# Altium schematic sheet lv_io_analog_input.SchDoc
size A4; Organization: Badgerloop; Address1: 133 Engineering Research; Address2: Building; Address3: Madison, WI 53715
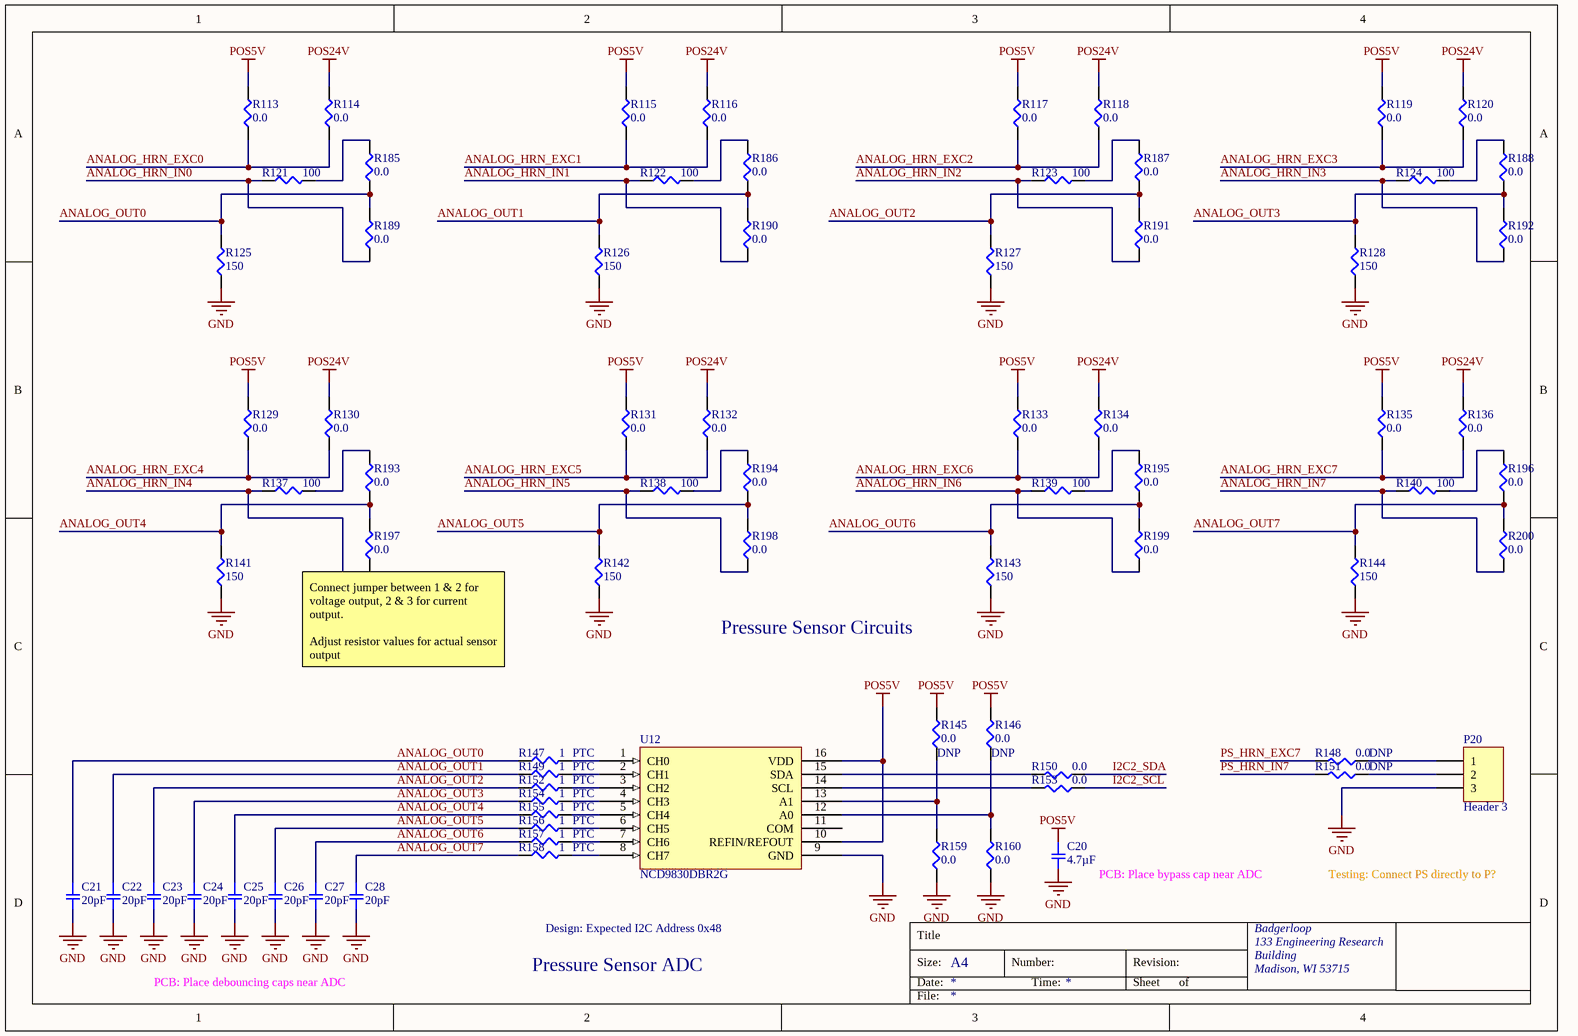
[diagram p0: lv_io_analog_input.SchDoc]

## Parts
C20  4.7µF  [SMD-0805C]
C21  20pF  [SMD-0402C]
C22  20pF  [SMD-0402C]
C23  20pF  [SMD-0402C]
C24  20pF  [SMD-0402C]
C25  20pF  [SMD-0402C]
C26  20pF  [SMD-0402C]
C27  20pF  [SMD-0402C]
C28  20pF  [SMD-0402C]
P20  Header 3  [Pin Header 1x3 TH Pitch 2.54mm]
R113  0.0  [SMD-0402-RES]
R114  0.0  [SMD-0402-RES]
R115  0.0  [SMD-0402-RES]
R116  0.0  [SMD-0402-RES]
R117  0.0  [SMD-0402-RES]
R118  0.0  [SMD-0402-RES]
R119  0.0  [SMD-0402-RES]
R120  0.0  [SMD-0402-RES]
R121  100  [SMD-0402-RES]
R122  100  [SMD-0402-RES]
R123  100  [SMD-0402-RES]
R124  100  [SMD-0402-RES]
R125  150  [SMD-0603-RES]
R126  150  [SMD-0603-RES]
R127  150  [SMD-0603-RES]
R128  150  [SMD-0603-RES]
R129  0.0  [SMD-0402-RES]
R130  0.0  [SMD-0402-RES]
R131  0.0  [SMD-0402-RES]
R132  0.0  [SMD-0402-RES]
R133  0.0  [SMD-0402-RES]
R134  0.0  [SMD-0402-RES]
R135  0.0  [SMD-0402-RES]
R136  0.0  [SMD-0402-RES]
R137  100  [SMD-0402-RES]
R138  100  [SMD-0402-RES]
R139  100  [SMD-0402-RES]
R140  100  [SMD-0402-RES]
R141  150  [SMD-0603-RES]
R142  150  [SMD-0603-RES]
R143  150  [SMD-0603-RES]
R144  150  [SMD-0603-RES]
R145  0.0  [SMD-0402-RES]
R146  0.0  [SMD-0402-RES]
R147  1  Features: PTC  [SMD-0603-RES]
R148  0.0  [SMD-0402-RES]
R149  1  Features: PTC  [SMD-0603-RES]
R150  0.0  [SMD-0402-RES]
R151  0.0  [SMD-0402-RES]
R152  1  Features: PTC  [SMD-0603-RES]
R153  0.0  [SMD-0402-RES]
R154  1  Features: PTC  [SMD-0603-RES]
R155  1  Features: PTC  [SMD-0603-RES]
R156  1  Features: PTC  [SMD-0603-RES]
R157  1  Features: PTC  [SMD-0603-RES]
R158  1  Features: PTC  [SMD-0603-RES]
R159  0.0  [SMD-0402-RES]
R160  0.0  [SMD-0402-RES]
R185  0.0  [SMD-0402-RES]
R186  0.0  [SMD-0402-RES]
R187  0.0  [SMD-0402-RES]
R188  0.0  [SMD-0402-RES]
R189  0.0  [SMD-0402-RES]
R190  0.0  [SMD-0402-RES]
R191  0.0  [SMD-0402-RES]
R192  0.0  [SMD-0402-RES]
R193  0.0  [SMD-0402-RES]
R194  0.0  [SMD-0402-RES]
R195  0.0  [SMD-0402-RES]
R196  0.0  [SMD-0402-RES]
R197  0.0  [SMD-0402-RES]
R198  0.0  [SMD-0402-RES]
R199  0.0  [SMD-0402-RES]
R200  0.0  [SMD-0402-RES]
U12  NCD9830DBR2G  [TSOP65P640X120_HS-17N]

## Nets
GND: C20.2 C21.2 C22.2 C23.2 C24.2 C25.2 C26.2 C27.2 C28.2 P20.3 R125.1 R126.1 R127.1 R128.1 R141.1 R142.1 R143.1 R144.1 R159.1 R160.1 U12.9(GND)
POS5V: C20.1 R113.2 R115.2 R117.2 R119.2 R129.2 R131.2 R133.2 R135.2 R145.2 R146.2 U12.10(REFIN/REFOUT) U12.16(VDD)
POS24V: R114.2 R116.2 R118.2 R120.2 R130.2 R132.2 R134.2 R136.2
ANALOG_HRN_EXC0: R113.1 R114.1
ANALOG_HRN_EXC1: R115.1 R116.1
ANALOG_HRN_EXC2: R117.1 R118.1
ANALOG_HRN_EXC3: R119.1 R120.1
ANALOG_HRN_EXC4: R129.1 R130.1
ANALOG_HRN_EXC5: R131.1 R132.1
ANALOG_HRN_EXC6: R133.1 R134.1
ANALOG_HRN_EXC7: R135.1 R136.1
ANALOG_HRN_IN0: R121.1 R189.1
ANALOG_HRN_IN1: R122.1 R190.1
ANALOG_HRN_IN2: R123.1 R191.1
ANALOG_HRN_IN3: R124.1 R192.1
ANALOG_HRN_IN4: R137.1 R197.1
ANALOG_HRN_IN5: R138.1 R198.1
ANALOG_HRN_IN6: R139.1 R199.1
ANALOG_HRN_IN7: R140.1 R200.1
ANALOG_OUT0: C21.1 R125.2 R147.1 R185.1 R189.2
ANALOG_OUT1: C22.1 R126.2 R149.1 R186.1 R190.2
ANALOG_OUT2: C23.1 R127.2 R152.1 R187.1 R191.2
ANALOG_OUT3: C24.1 R128.2 R154.1 R188.1 R192.2
ANALOG_OUT4: C25.1 R141.2 R155.1 R193.1 R197.2
ANALOG_OUT5: C26.1 R142.2 R156.1 R194.1 R198.2
ANALOG_OUT6: C27.1 R143.2 R157.1 R195.1 R199.2
ANALOG_OUT7: C28.1 R144.2 R158.1 R196.1 R200.2
I2C2_SCL: R153.1
I2C2_SDA: R150.1
PS_HRN_EXC7: R148.2
PS_HRN_IN7: R151.2
NetP20_1: P20.1 R148.1
NetP20_2: P20.2 R151.1
NetR121_2: R121.2 R185.2
NetR122_2: R122.2 R186.2
NetR123_2: R123.2 R187.2
NetR124_2: R124.2 R188.2
NetR137_2: R137.2 R193.2
NetR138_2: R138.2 R194.2
NetR139_2: R139.2 R195.2
NetR140_2: R140.2 R196.2
NetR145_1: R145.1 R159.2 U12.13(A1)
NetR146_1: R146.1 R160.2 U12.12(A0)
NetR147_2: R147.2 U12.1(CH0)
NetR149_2: R149.2 U12.2(CH1)
NetR150_2: R150.2 U12.15(SDA)
NetR152_2: R152.2 U12.3(CH2)
NetR153_2: R153.2 U12.14(SCL)
NetR154_2: R154.2 U12.4(CH3)
NetR155_2: R155.2 U12.5(CH4)
NetR156_2: R156.2 U12.6(CH5)
NetR157_2: R157.2 U12.7(CH6)
NetR158_2: R158.2 U12.8(CH7)

Not connected (* = marked no-connect by the designer): U12 11(COM)

## Notes on the sheet
- Pressure Sensor Circuits
- (near R197) Connect jumper between 1 & 2 for voltage output, 2 & 3 for current output.
  Adjust resistor values for actual sensor output
- (near C20) PCB: Place bypass cap near ADC
- Testing: Connect PS directly to P?
- PCB: Place debouncing caps near ADC
- Pressure Sensor ADC
- Design: Expected I2C Address 0x48
- Title
- Size:
- Date:
- A4
- Number:
- Time:
- Revision:
- Sheet
- of
- File:

## Library data of the parts
C20 = GRM21BR60J475KA11L: CAP CER 4.7UF 6.3V X5R 0805; Manufacturer: Murata Electronics North America; Factory Stock: 0; Unit Price (USD): 0.28; Minimum Quantity: 1; Tolerance: ±10%; Datasheets: http://www.murata.com/~/media/webrenewal/support/library/catalog/products/capacitor/mlcc/c02e.pdf; Image: //media.digikey.com/Renders/Murata%20Renders/0805%20(2012%20Metric)%20.85mm.jpg; Digi-Key Part Number: 490-9749-1-ND; Part Number: GRM21BR60J475KA11L; Quantity Available: 2821; @ qty: 0; Packaging: Cut Tape (CT); Series: GRM; Part Status: Active; Value: 4.7µF; Voltage: 6.3V; Temperature Coefficient: X5R; Operating Temperature: -55°C ~ 85°C; Features: -; Ratings: -; Applications: General Purpose; Mounting Type: Surface Mount, MLCC; Package / Case: 0805 (2012 Metric); Size / Dimension: 0.079" L x 0.049" W (2.00mm x 1.25mm); Height - Seated (Max): -; Thickness (Max): 0.055" (1.40mm); Lead Spacing: -; Lead Style: -
C21-C28 = GJM1555C1H200JB01D: CAP CER 20PF 50V NP0 0402; Manufacturer: Murata Electronics North America; Factory Stock: 0; Unit Price (USD): 0.1; Minimum Quantity: 1; Tolerance: ±5%; Temperature Coefficient: C0G, NP0; Datasheets: http://www.murata.com/~/media/webrenewal/support/library/catalog/products/capacitor/mlcc/c02e.pdf; Image: //media.digikey.com/Renders/Murata%20Renders/ZRB-SERIES-0402.jpg; Digi-Key Part Number: 490-3120-1-ND; Part Number: GJM1555C1H200JB01D; Quantity Available: 13133; @ qty: 0; Packaging: Cut Tape (CT); Series: GJM; Part Status: Active; Value: 20pF; Voltage: 50V; Operating Temperature: -55°C ~ 125°C; Features: High Q, Low Loss; Ratings: -; Applications: RF, Microwave, High Frequency; Mounting Type: Surface Mount, MLCC; Package / Case: 0402 (1005 Metric); Size / Dimension: 0.039" L x 0.020" W (1.00mm x 0.50mm); Height - Seated (Max): -; Thickness (Max): 0.022" (0.55mm); Lead Spacing: -; Lead Style: -
P20 = Header 3: Header, 3-Pin; LatestRevisionDate: 17-Jul-2002; LatestRevisionNote: Re-released for DXP Platform.; Publisher: Altium Limited
R113-R120 R129-R136 R145 R146 R148 R150 R151 R153 R159 R160 R185-R200 = ERJ-2GE0R00X: RES SMD 0.0OHM JUMPER 1/10W 0402; Manufacturer: Panasonic Electronic Components; Factory Stock: 0; Unit Price (USD): 0.00384; @ qty: 1500; Minimum Quantity: 1; Power (Watts): 0.1W, 1/10W; Part Number: ERJ-2GE0R00X; Datasheets: http://industrial.panasonic.com/www-cgi/jvcr13pz.cgi?E+PZ+3+AOA0001+ERJ2GE0R00X+7+WW; Image: //media.digikey.com/Photos/Panasonic%20Photos/ERJ-PA2-Series.jpg; Digi-Key Part Number: P0.0JCT-ND; Quantity Available: 3152483; Packaging: Cut Tape (CT); Series: ERJ; Part Status: Active; Value: 0.0; Tolerance: Jumper; Composition: Thick Film; Features: Automotive AEC-Q200; Temperature Coefficient: -; Operating Temperature: -55°C ~ 155°C; Package / Case: 0402 (1005 Metric); Supplier Device Package: 0402; Size / Dimension: 0.039" L x 0.020" W (1.00mm x 0.50mm); Height - Seated (Max): 0.016" (0.40mm); Number of Terminations: 2; Failure Rate: -
  R145 R146 R148 R151: DNP: DNP
R121-R124 R137-R140 = ERJ-2GEJ101X: RES SMD 100 OHM 5% 1/10W 0402; Manufacturer: Panasonic Electronic Components; Factory Stock: 0; Unit Price (USD): 0.00350; @ qty: 1500; Minimum Quantity: 1; Power (Watts): 0.1W, 1/10W; Temperature Coefficient: ±200ppm/°C; Part Number: ERJ-2GEJ101X; Datasheets: http://industrial.panasonic.com/www-cgi/jvcr13pz.cgi?E+PZ+3+AOA0001+ERJ2GEJ101X+7+WW; Image: //media.digikey.com/Photos/Panasonic%20Photos/ERJ-PA2-Series.jpg; Digi-Key Part Number: P100JCT-ND; Quantity Available: 3114113; Packaging: Cut Tape (CT); Series: ERJ; Part Status: Active; Value: 100; Tolerance: ±5%; Composition: Thick Film; Features: Automotive AEC-Q200; Operating Temperature: -55°C ~ 155°C; Package / Case: 0402 (1005 Metric); Supplier Device Package: 0402; Size / Dimension: 0.039" L x 0.020" W (1.00mm x 0.50mm); Height - Seated (Max): 0.016" (0.40mm); Number of Terminations: 2; Failure Rate: -
R125-R128 R141-R144 = ERJ-P03D1500V: RES SMD 150 OHM 0.5% 1/5W 0603; Manufacturer: Panasonic Electronic Components; Factory Stock: 0; Unit Price (USD): 0.06582; @ qty: 1500; Minimum Quantity: 1; Power (Watts): 0.2W, 1/5W; Temperature Coefficient: ±150ppm/°C; Part Number: ERJ-P03D1500V; Datasheets: https://industrial.panasonic.com/cdbs/www-data/pdf/RDA0000/AOA0000C243.pdf; Image: //media.digikey.com/Photos/Panasonic%20Photos/MFG_ERJ-P6W%20Series.jpg; Digi-Key Part Number: P16013CT-ND; Quantity Available: 4150; Packaging: Cut Tape (CT); Series: ERJ; Part Status: Active; Value: 150; Tolerance: ±0.5%; Composition: Thick Film; Features: Automotive AEC-Q200, Pulse Withstanding; Operating Temperature: -55°C ~ 155°C; Package / Case: 0603 (1608 Metric); Supplier Device Package: 0603; Size / Dimension: 0.063" L x 0.031" W (1.60mm x 0.80mm); Height - Seated (Max): 0.022" (0.55mm); Number of Terminations: 2; Failure Rate: -
R147 R149 R152 R154-R158 = PRG18BB470MB1RB: PTC RESET FUSE 6V 330MA 0603; Manufacturer P/N: PRG18BC1R0MM1RB; Manufacturer: Murata; Factory Stock: 0; Unit Price (USD): 0.10080; @ qty: 1500; Tolerance: ±1%; Power (Watts): 0.167W, 1/6W; Temperature Coefficient: ±250ppm/°C; Digikey Link: https://www.digikey.com/product-detail/en/murata-electronics-north-america/PRG18BC1R0MM1RB/490-8505-1-ND/4380768; Image: //media.digikey.com/Photos/Panasonic%20Photos/ERJ-PA2-Series.jpg; Digi-Key Part Number: 490-8505-1-ND; Quantity Available: 14922; Minimum Quantity: 1; Packaging: Cut Tape (CT); Part Status: Active; Value: 1; Composition: Thick Film; Operating Temperature: -55°C ~ 125°C; Package / Case: 0603; Supplier Device Package: 0402; Size / Dimension: 0.039" L x 0.020" W (1.00mm x 0.50mm); Height - Seated (Max): 0.016" (0.40mm); Number of Terminations: 2; Failure Rate: -
U12 = NCD9830DBR2G: IC ADC 8BIT 8CH I2C 16TSSOP; Manufacturer: ON Semiconductor; Digikey P/N: NCD9830DBR2GOSCT-ND; Digikey Link: https://www.digikey.com/product-detail/en/on-semiconductor/NCD9830DBR2G/NCD9830DBR2GOSCT-ND/9086945; Cost: 2.70; Manufacturer P/N: NCD9830DBR2G